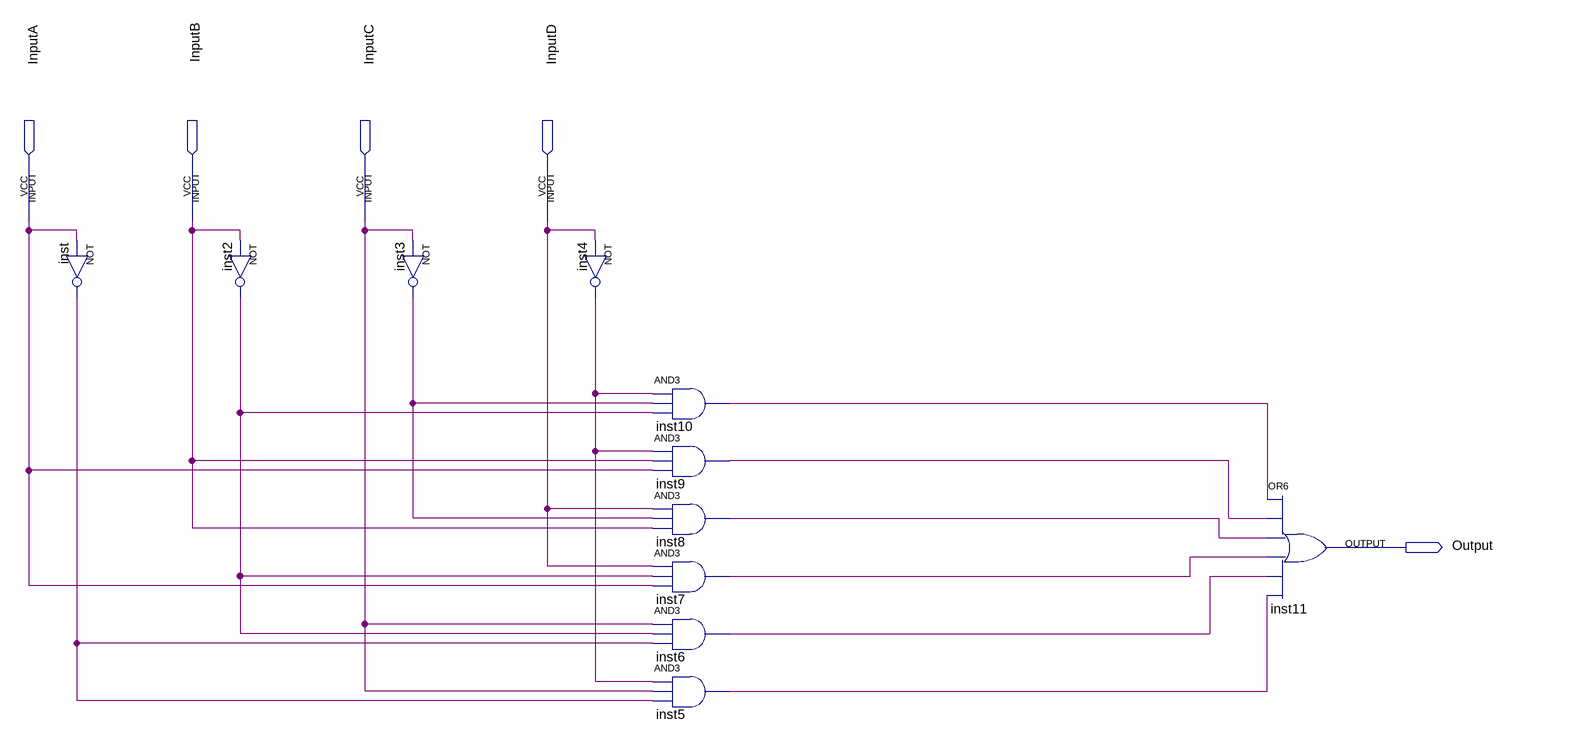
[diagram p0: schematic sheet]
// Quartus schematic SegD.bdf as structural Verilog: 11 symbols, 5 pins
module SegD (
  input  InputA,
  input  InputB,
  input  InputC,
  input  InputD,
  output Output
);

  wire inst2_out, inst3_out, inst4_out, inst5_out, inst6_out, inst7_out, inst8_out, inst9_out, inst10_out,
       inst_out;

  not inst (inst_out, InputA);
  not inst2 (inst2_out, InputB);
  not inst3 (inst3_out, InputC);
  not inst4 (inst4_out, InputD);
  and inst10 (inst10_out, inst4_out, inst3_out, inst2_out);
  and inst9 (inst9_out, inst4_out, InputB, InputA);
  and inst8 (inst8_out, InputD, inst3_out, InputB);
  and inst7 (inst7_out, InputD, inst2_out, InputA);
  and inst6 (inst6_out, InputC, inst2_out, inst_out);
  and inst5 (inst5_out, inst4_out, InputC, inst_out);
  or inst11 (Output, inst10_out, inst9_out, inst8_out, inst7_out, inst6_out, inst5_out);
endmodule
